# EAGLE schematic uzed-hmdi (EAGLE 8.6.1)

## Sheet 1 of 2: berstak
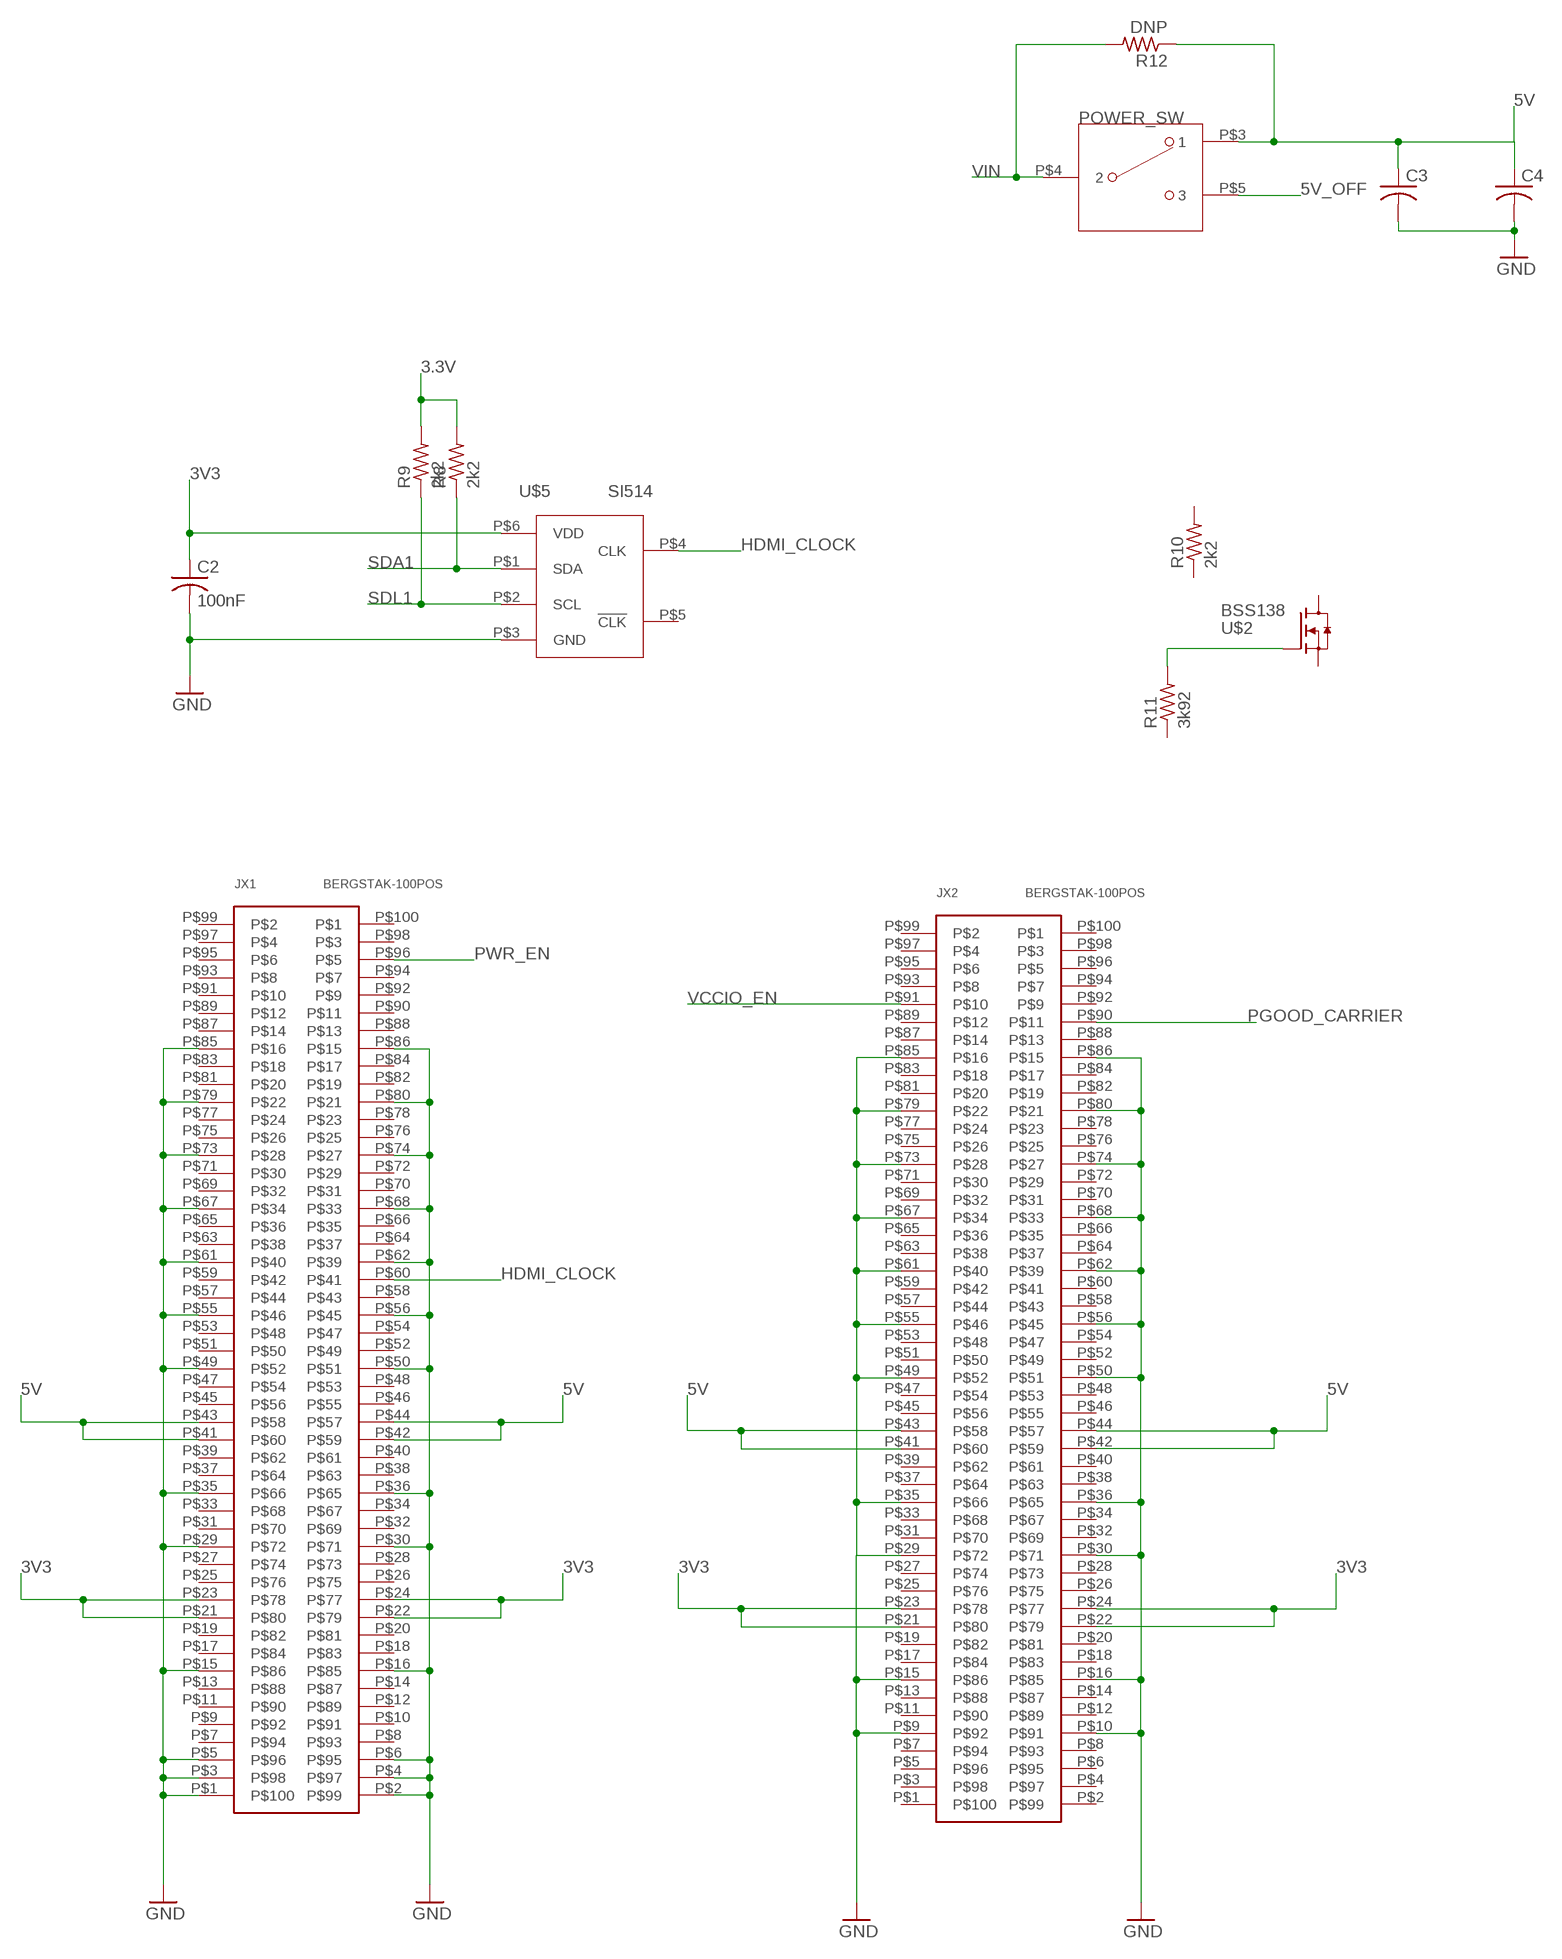
[diagram p0: schematic, sheet 1]

### Parts
C2  100nF  C-USC0603  [C0603]
C3  C-USC0603  [C0603]
C4  C-USC1206K  [C1206K]
JX1  BERGSTAK-100POS  [BERG100POS]
JX2  BERGSTAK-100POS  [BERG100POS]
POWER_SW  T511006  [SPDT]
R8  2k2  R-US_R0603  [R0603]
R9  2k2  R-US_R0603  [R0603]
R10  2k2  R-US_R0603  [R0603]
R11  3k92  R-US_R0603  [R0603]
R12  DNP  R-US_R0603  [R0603]
U$2  BSS138  [SOT23]
U$5  SI514  [XTAL-6PIN]

### Nets
3.3V: R8.2 R9.2
3V3: C2.1 JX1.P$21 JX1.P$22 JX1.P$23 JX1.P$24 JX2.P$21 JX2.P$22 JX2.P$23 JX2.P$24 U$5.P$6(VDD) ; also sheet 2
5V: C3.1 C4.1 JX1.P$41 JX1.P$42 JX1.P$43 JX1.P$44 JX2.P$41 JX2.P$42 JX2.P$43 JX2.P$44 POWER_SW.P$3 R12.1 ; also sheet 2
5V_OFF: POWER_SW.P$5
GND: C2.2 C3.2 C4.2 JX1.P$1 JX1.P$2 JX1.P$3 JX1.P$4 JX1.P$5 JX1.P$6 JX1.P$15 JX1.P$16 JX1.P$29 JX1.P$30 JX1.P$35 JX1.P$36 JX1.P$49 JX1.P$50 JX1.P$55 JX1.P$56 JX1.P$61 JX1.P$62 JX1.P$67 JX1.P$68 JX1.P$73 JX1.P$74 JX1.P$79 JX1.P$80 JX1.P$85 JX1.P$86 JX2.P$9 JX2.P$10 JX2.P$15 JX2.P$16 JX2.P$29 JX2.P$30 JX2.P$35 JX2.P$36 JX2.P$49 JX2.P$50 JX2.P$55 JX2.P$56 JX2.P$61 JX2.P$62 JX2.P$67 JX2.P$68 JX2.P$73 JX2.P$74 JX2.P$79 JX2.P$80 JX2.P$85 JX2.P$86 U$5.P$3(GND) ; also sheet 2
HDMI_CLOCK: JX1.P$60 U$5.P$4(CLK)
N$2: R11.2 U$2.1(G)
PGOOD_CARRIER: JX2.P$90
PWR_EN: JX1.P$96
SDA1: R8.1 U$5.P$1(SDA)
SDL1: R9.1 U$5.P$2(SCL)
VCCIO_EN: JX2.P$91
VIN: POWER_SW.P$4 R12.2
Unconnected: JX1.P$7 JX1.P$8 JX1.P$9 JX1.P$10 JX1.P$11 JX1.P$12 JX1.P$13 JX1.P$14 JX1.P$17 JX1.P$18 JX1.P$19 JX1.P$20 JX1.P$25 JX1.P$26 JX1.P$27 JX1.P$28 JX1.P$31 JX1.P$32 JX1.P$33 JX1.P$34 JX1.P$37 JX1.P$38 JX1.P$39 JX1.P$40 JX1.P$45 JX1.P$46 JX1.P$47 JX1.P$48 JX1.P$51 JX1.P$52 JX1.P$53 JX1.P$54 JX1.P$57 JX1.P$58 JX1.P$59 JX1.P$63 JX1.P$64 JX1.P$65 JX1.P$66 JX1.P$69 JX1.P$70 JX1.P$71 JX1.P$72 JX1.P$75 JX1.P$76 JX1.P$77 JX1.P$78 JX1.P$81 JX1.P$82 JX1.P$83 JX1.P$84 JX1.P$87 JX1.P$88 JX1.P$89 JX1.P$90 JX1.P$91 JX1.P$92 JX1.P$93 JX1.P$94 JX1.P$95 JX1.P$97 JX1.P$98 JX1.P$99 JX1.P$100 JX2.P$1 JX2.P$2 JX2.P$3 JX2.P$4 JX2.P$5 JX2.P$6 JX2.P$7 JX2.P$8 JX2.P$11 JX2.P$12 JX2.P$13 JX2.P$14 JX2.P$17 JX2.P$18 JX2.P$19 JX2.P$20 JX2.P$25 JX2.P$26 JX2.P$27 JX2.P$28 JX2.P$31 JX2.P$32 JX2.P$33 JX2.P$34 JX2.P$37 JX2.P$38 JX2.P$39 JX2.P$40 JX2.P$45 JX2.P$46 JX2.P$47 JX2.P$48 JX2.P$51 JX2.P$52 JX2.P$53 JX2.P$54 JX2.P$57 JX2.P$58 JX2.P$59 JX2.P$60 JX2.P$63 JX2.P$64 JX2.P$65 JX2.P$66 JX2.P$69 JX2.P$70 JX2.P$71 JX2.P$72 JX2.P$75 JX2.P$76 JX2.P$77 JX2.P$78 JX2.P$81 JX2.P$82 JX2.P$83 JX2.P$84 JX2.P$87 JX2.P$88 JX2.P$89 JX2.P$92 JX2.P$93 JX2.P$94 JX2.P$95 JX2.P$96 JX2.P$97 JX2.P$98 JX2.P$99 JX2.P$100 R10.1 R10.2 R11.1 U$2.2(S) U$2.3(D) U$5.P$5(!CLK)

## Sheet 2 of 2: HDMI Terminations
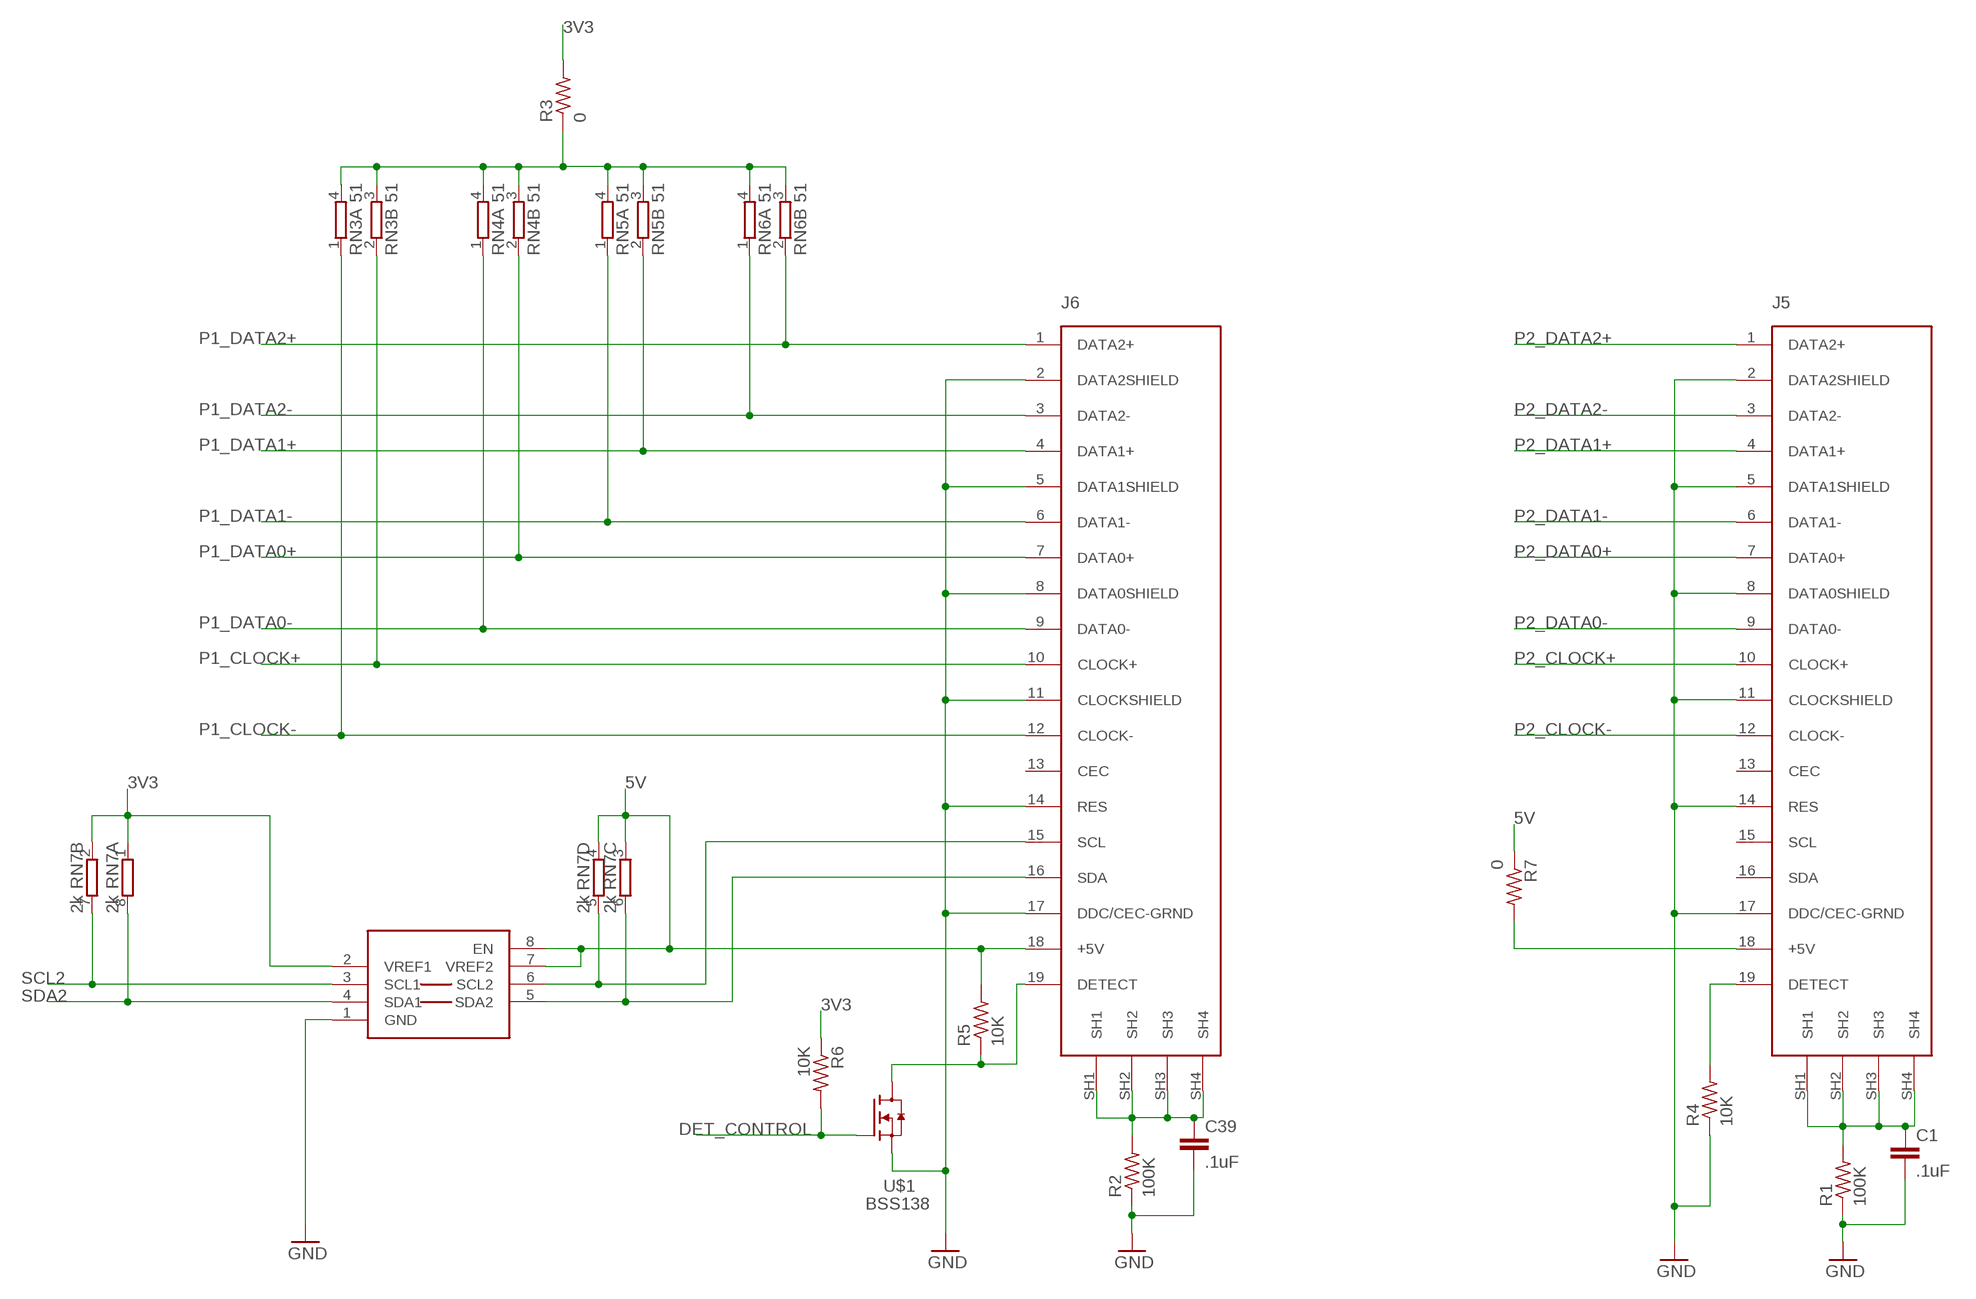
[diagram p1: schematic, sheet 2]

### Parts
C1  .1uF  C-EUC0603K  [C0603K]
C39  .1uF  C-EUC0603K  [C0603K]
J5  HDMI-TYPE-A-RECEPTICALFCI10029449  [FCI-HDMI-TYPE-A-RECEPT]
J6  HDMI-TYPE-A-RECEPTICALFCI10029449  [FCI-HDMI-TYPE-A-RECEPT]
PCA9306  PCA9306  [PSOP-8]
R1  100K  R-US_R0603  [R0603]
R2  100K  R-US_R0603  [R0603]
R3  0  R-US_R0603  [R0603]
R4  10K  R-US_R0603  [R0603]
R5  10K  R-US_R0603  [R0603]
R6  10K  R-US_R0603  [R0603]
R7  0  R-US_R0603  [R0603]
RN3  51  2R-NEXB34V  [EXB34V]
RN4  51  2R-NEXB34V  [EXB34V]
RN5  51  2R-NEXB34V  [EXB34V]
RN6  51  2R-NEXB34V  [EXB34V]
RN7  2k  4R-N0603-ARV  [0603-ARV]
U$1  BSS138  [SOT23]

### Nets
3V3: PCA9306.2(VREF1) R3.2 R6.1 RN7.1 RN7.2 ; also sheet 1
5V: J6.18(+5V) PCA9306.7(VREF2) PCA9306.8(EN) R5.2 R7.1 RN7.3 RN7.4 ; also sheet 1
DET_CONTROL: R6.2 U$1.1(G)
GND: C1.2 C39.2 J5.2(DATA2SHIELD) J5.5(DATA1SHIELD) J5.8(DATA0SHIELD) J5.11(CLOCKSHIELD) J5.14(RES) J5.17(DDC/CEC-GRND) J6.2(DATA2SHIELD) J6.5(DATA1SHIELD) J6.8(DATA0SHIELD) J6.11(CLOCKSHIELD) J6.14(RES) J6.17(DDC/CEC-GRND) PCA9306.1(GND) R1.1 R2.1 R4.1 U$1.2(S) ; also sheet 1
N$1: C1.1 J5.SH1 J5.SH2 J5.SH3 J5.SH4 R1.2
N$10: J5.19(DETECT) R4.2
N$11: R3.1 RN3.3 RN3.4 RN4.3 RN4.4 RN5.3 RN5.4 RN6.3 RN6.4
N$12: J6.19(DETECT) R5.1 U$1.3(D)
N$14: J5.18(+5V) R7.2
N$15: J6.16(SDA) PCA9306.5(SDA2) RN7.6
N$16: J6.15(SCL) PCA9306.6(SCL2) RN7.5
N$34: C39.1 J6.SH1 J6.SH2 J6.SH3 J6.SH4 R2.2
P1_CLOCK+: J6.10(CLOCK+) RN3.2
P1_CLOCK-: J6.12(CLOCK-) RN3.1
P1_DATA0+: J6.7(DATA0+) RN4.2
P1_DATA0-: J6.9(DATA0-) RN4.1
P1_DATA1+: J6.4(DATA1+) RN5.2
P1_DATA1-: J6.6(DATA1-) RN5.1
P1_DATA2+: J6.1(DATA2+) RN6.2
P1_DATA2-: J6.3(DATA2-) RN6.1
P2_CLOCK+: J5.10(CLOCK+)
P2_CLOCK-: J5.12(CLOCK-)
P2_DATA0+: J5.7(DATA0+)
P2_DATA0-: J5.9(DATA0-)
P2_DATA1+: J5.4(DATA1+)
P2_DATA1-: J5.6(DATA1-)
P2_DATA2+: J5.1(DATA2+)
P2_DATA2-: J5.3(DATA2-)
SCL2: PCA9306.3(SCL1) RN7.7
SDA2: PCA9306.4(SDA1) RN7.8
Unconnected: J5.13(CEC) J5.15(SCL) J5.16(SDA) J6.13(CEC)

## Library data of the parts
C1 C39 = rcl:C-EU: CAPACITOR, European symbol
C2-C4 = rcl:C-US: CAPACITOR, American symbol; SPICEPREFIX: C
J5 J6 = saanlima:HDMI-TYPE-A-RECEPTICAL
JX1 JX2 = lupa300-components:BERGSTAK-100POS
PCA9306 = saanlima:PCA9306
POWER_SW = lupa300-components:T511006: Slide Switch SPDT Through Hole, Right Angle
R1 R2 R4-R7 = rcl:R-US_: RESISTOR, American symbol
R3 R8-R12 = rcl:R-US_: RESISTOR, American symbol; SPICEPREFIX: R
RN3-RN6 = resistor-dil:2R-N: Array Chip Resistor Source: Panasonic; OC_FARNELL: unknown; OC_NEWARK: unknown
RN7 = resistor-dil:4R-N: Array Chip Resistor Source: RS Component / Phycomp; OC_FARNELL: unknown; OC_NEWARK: unknown
U$1 U$2 = lupa300-components:BSS138: N-Channel 50V 220mA (Ta) 360mW (Ta) Surface Mount SOT-23-3
U$5 = lupa300-components:SI514